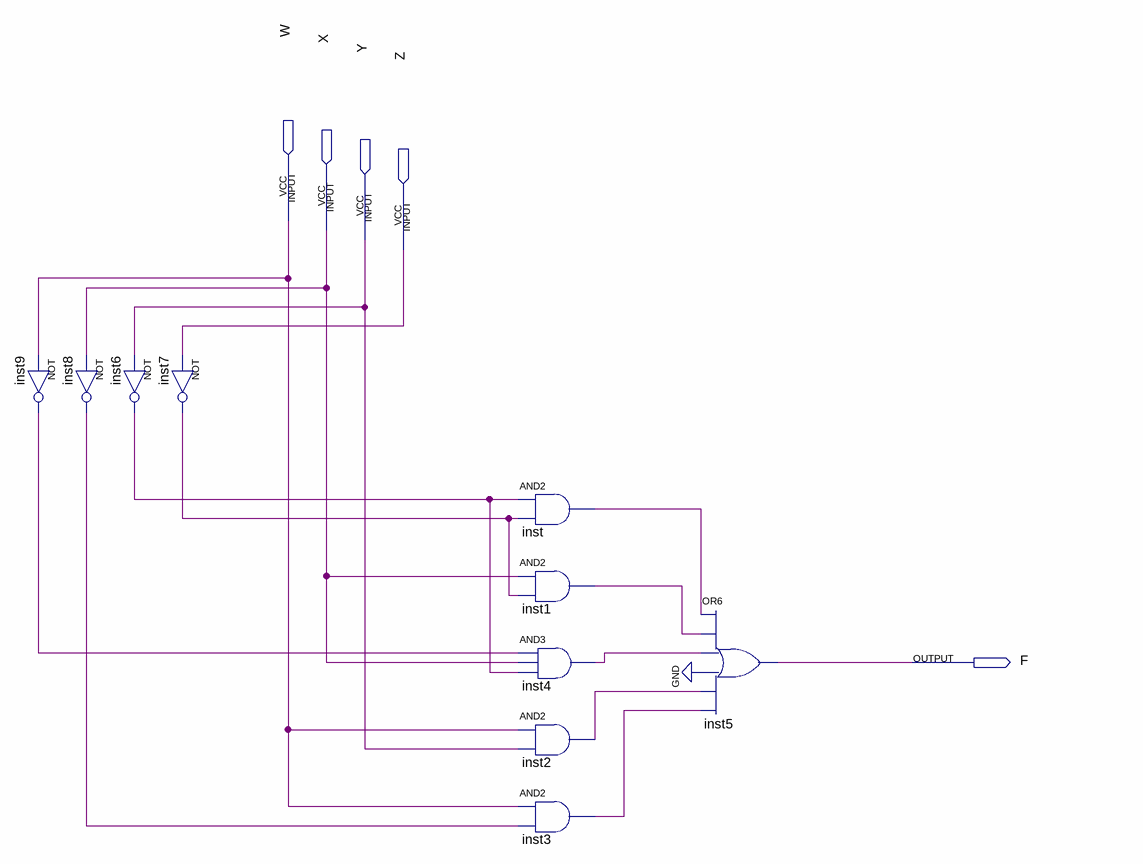
[diagram p0: schematic sheet]
// Quartus schematic SEG_F.bdf as structural Verilog: 10 symbols, 5 pins
module SEG_F (
  input  W,
  input  X,
  input  Y,
  input  Z,
  output F
);

  wire inst1_out, inst2_out, inst3_out, inst4_out, inst6_out, inst7_out, inst8_out, inst9_out, inst_out;

  not inst9 (inst9_out, W);
  not inst8 (inst8_out, X);
  not inst6 (inst6_out, Y);
  not inst7 (inst7_out, Z);
  and inst (inst_out, inst6_out, inst7_out);
  and inst1 (inst1_out, X, inst7_out);
  and inst4 (inst4_out, inst9_out, X, inst6_out);
  and inst2 (inst2_out, W, Y);
  and inst3 (inst3_out, W, inst8_out);
  or inst5 (F, inst_out, inst1_out, inst4_out, 1'b0, inst2_out, inst3_out);
endmodule
